# EAGLE schematic Ekspander (EAGLE 9.3.0)
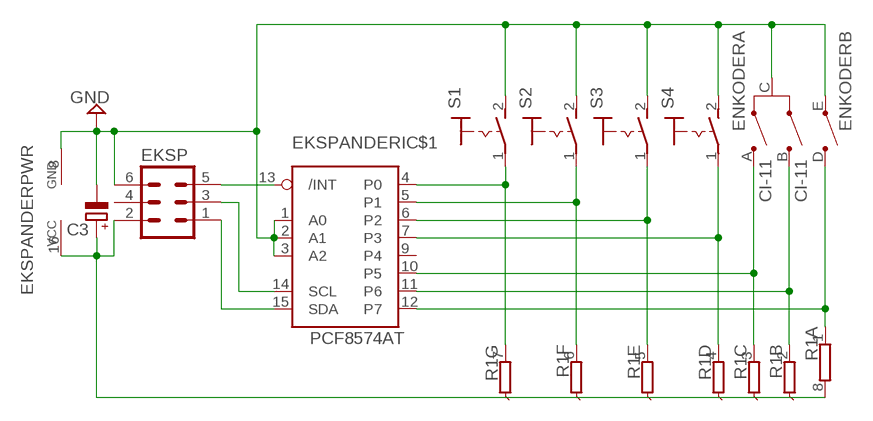
[diagram p0: schematic, sheet 1]

## Parts
C3  CPOL-EU140CLH-1010  [140CLH-1010]
EKSP  ML6  [ML6]
EKSPANDER  PCF8574AT  [SO16]
ENKODER  CI-11  [CI-11]
R1  2NBS08-7E  [SO8]
S1  MS243  [MS243]
S2  MS243  [MS243]
S3  MS243  [MS243]
S4  MS243  [MS243]

## Nets
GND: C3.- EKSP.6 EKSPANDER.1(IC$1:A0) EKSPANDER.2(IC$1:A1) EKSPANDER.3(IC$1:A2) EKSPANDER.8(PWR:GND) ENKODER.C(A:C) ENKODER.E(B:E) S1.2(S) S2.2(S) S3.2(S) S4.2(S)
N$1: EKSP.5 EKSPANDER.13(IC$1:/INT)
N$2: EKSP.1 EKSPANDER.15(IC$1:SDA)
N$3: EKSP.3 EKSPANDER.14(IC$1:SCL)
N$4: C3.+ EKSP.2 EKSPANDER.16(PWR:VCC) R1.8
N$5: EKSPANDER.12(IC$1:P7) ENKODER.D(B:D) R1.1
N$6: EKSPANDER.11(IC$1:P6) ENKODER.B(A:B) R1.2
N$7: EKSPANDER.10(IC$1:P5) ENKODER.A(A:A) R1.3
N$8: EKSPANDER.7(IC$1:P3) R1.4 S4.1(P)
N$9: EKSPANDER.6(IC$1:P2) R1.5 S3.1(P)
N$10: EKSPANDER.5(IC$1:P1) R1.6 S2.1(P)
N$11: EKSPANDER.4(IC$1:P0) R1.7 S1.1(P)
Unconnected: EKSP.4 EKSPANDER.9(IC$1:P4)

## Library data of the parts
C3 = rcl:CPOL-EU: POLARIZED CAPACITOR, European symbol; SPICEPREFIX: C
EKSP = con-harting-ml:ML6: HARTING; OC_FARNELL: unknown; OC_NEWARK: unknown
EKSPANDER = i2c:PCF8574: Remote 8-Bit I/O Expander for I²C Bus
ENKODER = piher:CI-11: 11mm Incemental Encoder Source: www.piher.net .. 04-CI-11v04.pdf; OC_FARNELL: unknown; OC_NEWARK: unknown
R1 = resistor-bourns:2NBS08-7E: BOURNS RESISTOR NETWORK; OC_FARNELL: unknown; OC_NEWARK: unknown
S1-S4 = switch:MS243: TOGGLE SWITCH